# Altium schematic sheet STM32103C8T6.SchDoc
size A4; SheetNumber: 1; SheetTotal: 2
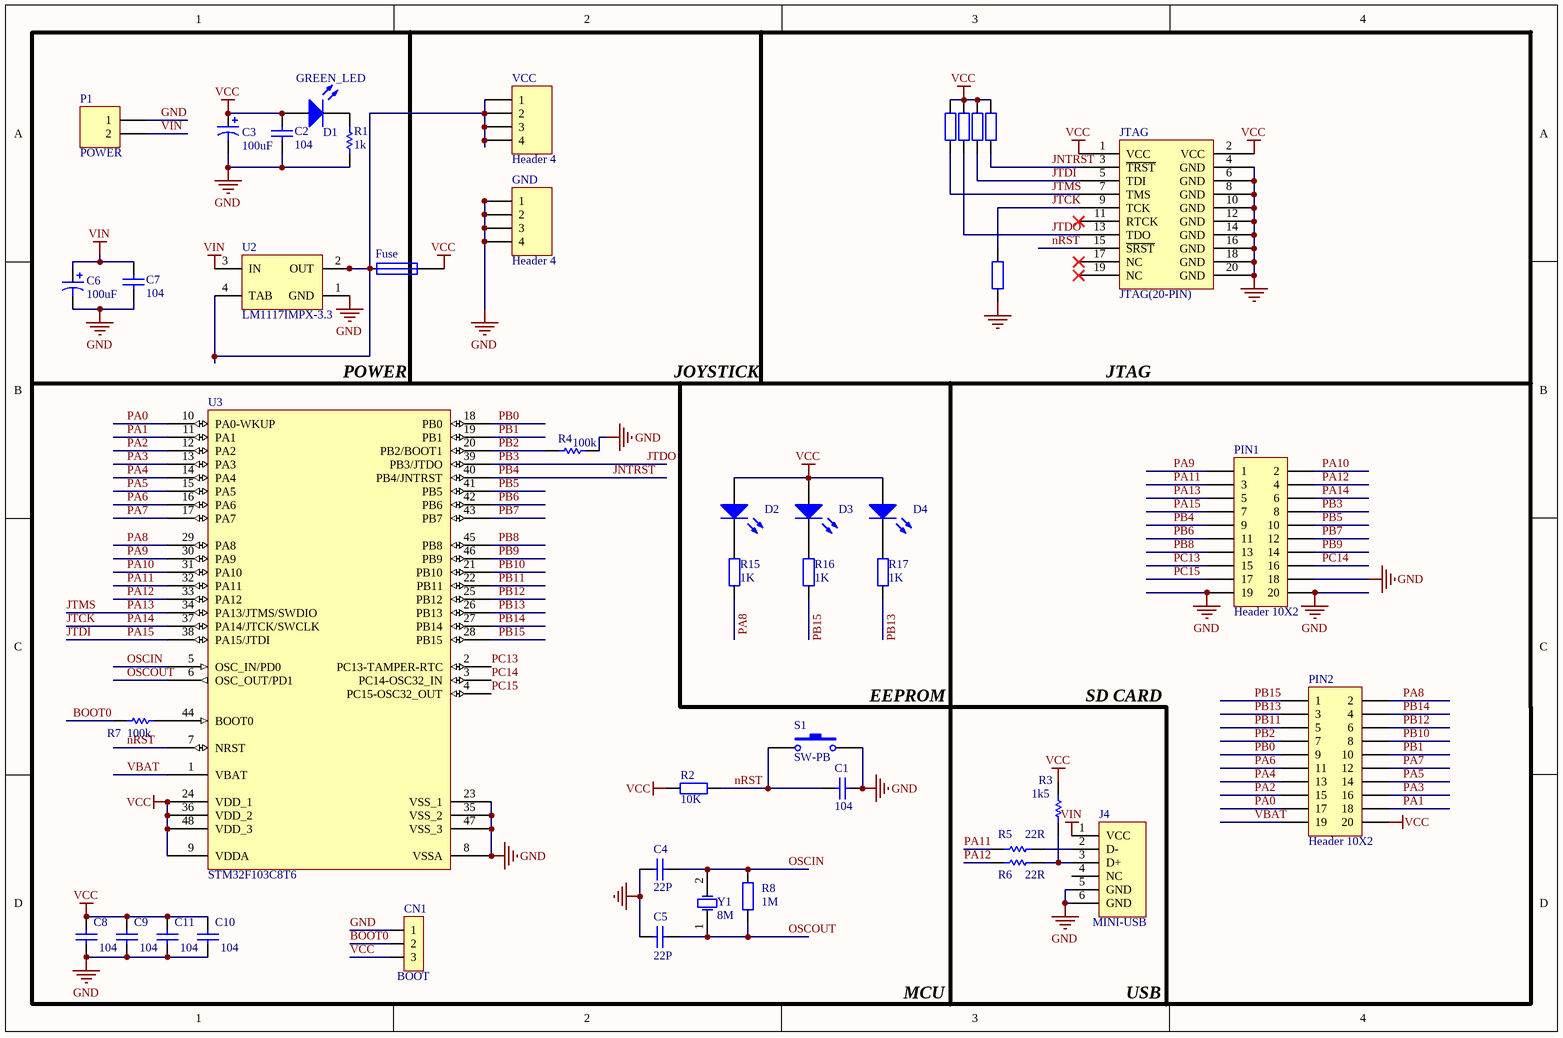
[diagram p0: STM32103C8T6.SchDoc]

## Parts
C1  value 104  [0805]  (hidden comment: Cap Semi)
C2  value 104  [0805]  (hidden comment: Cap Semi)
C3  value 100uF  [1206]  (hidden comment: Cap Pol1)
C4  22P  [0805]
C5  22P  [0805]
C6  value 100uF  [1206]  (hidden comment: Cap Pol1)
C7  value 104  [0805]  (hidden comment: Cap Semi)
C8  value 104  [0603]  (hidden comment: Cap Semi)
C9  value 104  [0603]  (hidden comment: Cap Semi)
C10  value 104  [0603]  (hidden comment: Cap Semi)
C11  value 104  [0603]  (hidden comment: Cap Semi)
CN1  BOOT  [KEY_22D00]
D1  GREEN_LED  [LED_0805]
D2  LED0  [0805]  (value not drawn)
D3  LED0  [0805]  (value not drawn)
D4  LED0  [0805]  (value not drawn)
Fuse  Fuse 1  [0805]  (value not drawn)
GND  Header 4  [HDR1X4]
J4  MINI-USB  [MINI_USB]
JTAG  JTAG(20-PIN)  [JP20_DOMNLOAD]
P1  POWER  [XH2.54-2]
PIN1  Header 10X2  [HDR2X10]
PIN2  Header 10X2  [HDR2X10]
R1  value 1k  [0805]  (hidden comment: Res Semi)
R2  value 10K  [0805]  (hidden comment: Res2)
R3  value 1k5  [0805]  (hidden comment: Res Semi)
R4  value 100k  [0805]  (hidden comment: Res Semi)
R5  value 22R  [0805]  (hidden comment: Res Semi)
R6  value 22R  [0805]  (hidden comment: Res Semi)
R7  value 100k  [0805]  (hidden comment: Res Semi)
R8  1M  [0805]
R10  10K  [0805]  (value not drawn)
R11  10K  [0805]  (value not drawn)
R12  10K  [0805]  (value not drawn)
R13  10K  [0805]  (value not drawn)
R14  10K  [0805]  (value not drawn)
R15  1K  [0805]
R16  1K  [0805]
R17  1K  [0805]
S1  SW-PB  [×ØÉ«Ð¡°´¼ü¿ª¹Ø]
U2  LM1117IMPX-3.3  [MP04A_N]
U3  STM32F103C8T6  [LQFP48_L]
VCC  Header 4  [HDR1X4]
Y1  8M  [XTAL]

## Nets
GND: C1.2 C2.2 C3.2 C4.2 C5.2 C6.2 C7.2 C8.2 C9.2 C10.2 C11.2 CN1.1 GND.1 GND.2 GND.3 GND.4 J4.5(GND) J4.6(GND) JTAG.4(GND) JTAG.6(GND) JTAG.8(GND) JTAG.10(GND) JTAG.12(GND) JTAG.14(GND) JTAG.16(GND) JTAG.18(GND) JTAG.20(GND) P1.1 PIN1.18 PIN1.19 PIN1.20 R1.1 R4.2 R10.1 S1.2 U2.1(GND) U3.8(VSSA) U3.23(VSS_1) U3.35(VSS_2) U3.47(VSS_3)
VCC: C2.1 C3.1 C8.1 C9.1 C10.1 C11.1 CN1.3 D1.1(A) D2.1(A) D3.1(A) D4.1(A) Fuse.1 JTAG.1(VCC) JTAG.2(VCC) PIN2.20 R2.1 R3.2 R11.2 R12.2 R13.2 R14.2 U3.9(VDDA) U3.24(VDD_1) U3.36(VDD_2) U3.48(VDD_3)
VIN: C6.1 C7.1 J4.1(VCC) P1.2 U2.3(IN)
BOOT0: CN1.2 R7.1
JNTRST: JTAG.3(~{TRST}) PIN1.9 R14.1 U3.40(PB4/JNTRST)  [also labelled PB4]
JTCK: JTAG.9(TCK) PIN1.6 R10.2 U3.37(PA14/JTCK/SWCLK)  [also labelled PA14]
JTDI: JTAG.5(TDI) PIN1.7 R13.1 U3.38(PA15/JTDI)  [also labelled PA15]
JTDO: JTAG.13(TDO) PIN1.8 R12.1 U3.39(PB3/JTDO)  [also labelled PB3]
JTMS: JTAG.7(TMS) PIN1.5 R11.1 U3.34(PA13/JTMS/SWDIO)  [also labelled PA13]
nRST: C1.1 JTAG.15(~{SRST}) R2.2 S1.1 U3.7(NRST)
OSCIN: C4.1 R8.2 U3.5(OSC_IN/PD0) Y1.2(OSC2)
OSCOUT: C5.1 R8.1 U3.6(OSC_OUT/PD1) Y1.1(OSC1)
PA0: PIN2.17 U3.10(PA0-WKUP)
PA1: PIN2.18 U3.11(PA1)
PA2: PIN2.15 U3.12(PA2)
PA3: PIN2.16 U3.13(PA3)
PA4: PIN2.13 U3.14(PA4)
PA5: PIN2.14 U3.15(PA5)
PA6: PIN2.11 U3.16(PA6)
PA7: PIN2.12 U3.17(PA7)
PA8: PIN2.2 R15.1 U3.29(PA8)
PA9: PIN1.1 U3.30(PA9)
PA10: PIN1.2 U3.31(PA10)
PA11: PIN1.3 R5.1 U3.32(PA11)
PA12: PIN1.4 R6.1 U3.33(PA12)
PB0: PIN2.9 U3.18(PB0)
PB1: PIN2.10 U3.19(PB1)
PB2: PIN2.7 R4.1 U3.20(PB2/BOOT1)
PB5: PIN1.10 U3.41(PB5)
PB6: PIN1.11 U3.42(PB6)
PB7: PIN1.12 U3.43(PB7)
PB8: PIN1.13 U3.45(PB8)
PB9: PIN1.14 U3.46(PB9)
PB10: PIN2.8 U3.21(PB10)
PB11: PIN2.5 U3.22(PB11)
PB12: PIN2.6 U3.25(PB12)
PB13: PIN2.3 R17.1 U3.26(PB13)
PB14: PIN2.4 U3.27(PB14)
PB15: PIN2.1 R16.1 U3.28(PB15)
PC13: PIN1.15 U3.2(PC13-TAMPER-RTC)
PC14: PIN1.16 U3.3(PC14-OSC32_IN)
PC15: PIN1.17 U3.4(PC15-OSC32_OUT)
VBAT: PIN2.19 U3.1(VBAT)
NetD1_2: D1.2(K) R1.2
NetD2_2: D2.2(K) R15.2
NetD3_2: D3.2(K) R16.2
NetD4_2: D4.2(K) R17.2
NetFuse_2: Fuse.2 U2.2(OUT) U2.4(TAB) VCC.1 VCC.2 VCC.3 VCC.4
NetJ4_2: J4.2(D-) R5.2
NetJ4_3: J4.3(D+) R3.1 R6.2
NetR7_2: R7.2 U3.44(BOOT0)

Not connected (* = marked no-connect by the designer): J4 4(NC); JTAG 11(RTCK)* 17(NC)* 19(NC)*

## Notes on the sheet
- (near U3) POWER
- JOYSTICK
- JTAG
- (near S1) EEPROM
- SD CARD
- MCU
- USB

## Library data of the parts
C1 C2 C7-C11 = Cap Semi: Capacitor (Semiconductor SIM Model); Published: 8-Jun-2000; LatestRevisionDate: 17-Jul-2002; LatestRevisionNote: Re-released for DXP Platform.; PackageReference: C1206; Publisher: Altium Limited
C3 C6 = Cap Pol1: Polarized Capacitor (Radial); Published: 8-Jun-2000; LatestRevisionDate: 17-Jul-2002; LatestRevisionNote: Re-released for DXP Platform.; PackageReference: RB7.6-15; Publisher: Altium Limited
C4 C5 = Cap: Capacitor; Value: 100pF; Published: 8-Jun-2000; Revision: July-2002: Re-released for DXP Platform.; Publisher: Altium Limited
CN1 = CON3
D1 = LED3: Typical BLUE SiC LED; Published: 8-Jun-2000; LatestRevisionDate: 17-Dec-2003; LatestRevisionNote: PCB Footprint replaced.; DatasheetDocument: 16-Apr-2002; PackageDocument: 16-Apr-2002; PackageReference: 3.5X2.8X1.9; Publisher: Altium Limited
D2-D4 = LED0: Typical INFRARED GaAs LED; Published: 8-Jun-2000; LatestRevisionDate: 08-Jul-2005; LatestRevisionNote: Mech Layer 1 removed.; PackageReference: LED-0; Publisher: Altium Limited; PackageDescription: LED; 2 Leads
Fuse = Fuse 1: Fuse; Published: 8-Jun-2000; LatestRevisionDate: 17-Jul-2002; LatestRevisionNote: Re-released for DXP Platform.; PackageReference: PIN-W2/E2.8; Publisher: Altium Limited; PackageDescription: Thru-Hole; 2 Leads
GND VCC = Header 4: Header, 4-Pin; LatestRevisionDate: 17-Jul-2002; LatestRevisionNote: Re-released for DXP Platform.; Publisher: Altium Limited
J4 = USB-MINI
P1 = Header 2: Header, 2-Pin; LatestRevisionDate: 17-Jul-2002; LatestRevisionNote: Re-released for DXP Platform.; Publisher: Altium Limited
PIN1 PIN2 = Header 10X2: Header, 10-Pin, Dual row; LatestRevisionDate: 17-Jul-2002; LatestRevisionNote: Re-released for DXP Platform.; Publisher: Altium Limited
R1 R3-R7 = Res Semi: Semiconductor Resistor; Published: 8-Jun-2000; LatestRevisionDate: 17-Jul-2002; LatestRevisionNote: Re-released for DXP Platform.; PackageReference: AXIAL-0.5; Publisher: Altium Limited
R2 R15-R17 = Res2: Resistor; Published: 8-Jun-2000; Publisher: Altium Limited
  R2: LatestRevisionDate: 17-Jul-2002; LatestRevisionNote: Re-released for DXP Platform.; PackageReference: AXIAL-0.4; PackageDescription: Axial Device, Thru-Hole; 2 Leads; 0.4 in Pin Spacing
  R15-R17: Revision: July-2002: Re-released for DXP Platform.; Value: 1K
R8 R10-R14 = Res2: Resistor; Value: 1K; Published: 8-Jun-2000; Revision: July-2002: Re-released for DXP Platform.; Publisher: Altium Limited
S1 = SW-PB: Switch; Published: 24-Mar-1999; LatestRevisionDate: 17-Jul-2002; LatestRevisionNote: Re-released for DXP Platform.; PackageReference: SPST-2; Publisher: Altium Limited; PackageDescription: Switch; 2 Leads
U2 = LM1117IMPX-3.3: 800mA Low-Dropout Linear Regulator, 4-pin SOT-223; Manufacturer: National Semiconductor; PackageTopMarking: XYTT*N05B; PowerWise: N; CompType: LDO IC; Published: 1-Mar-2010; DatasheetVersion: Apr-2006; PackageVersion: revB, Apr-2003; PackageReference: MP04A; Publisher: Altium Limited; PackageDescription: Molded SOT-223, 6.50 x 3.56 x 1.6mm Body, 4 Lead, 2.3mm Pitch; PartNumber: LM1117IMPX-3.3; RoHS: N; PinCount: 4; Code_JEDEC: TO-261-AA; Code_IPC: SOT223-4; ComponentLink1Description: LM1117 Datasheet; ComponentLink1URL: http://www.national.com/ds/LM/LM1117.pdf; ComponentLink2Description: LM1117 Web Page; ComponentLink2URL: http://www.national.com/pf/LM/LM1117.html; ComponentLink3Description: MP04A Package Page; ComponentLink3URL: http://www.national.com/packaging/folders/mp04a.html
U3 = STM32F103C8T6: STM32 ARM-based 32-bit MCU with 64 Kbytes Flash, 48-pin LQFP, Industrial Temperature
Y1 = XTAL: Crystal Oscillator; Published: 8-Jun-2000; Revision: July-2002: Re-released for DXP Platform.; Publisher: Altium Limited